# EAGLE schematic Payload (EAGLE 9.6.2)

## Sheet 1 of 2
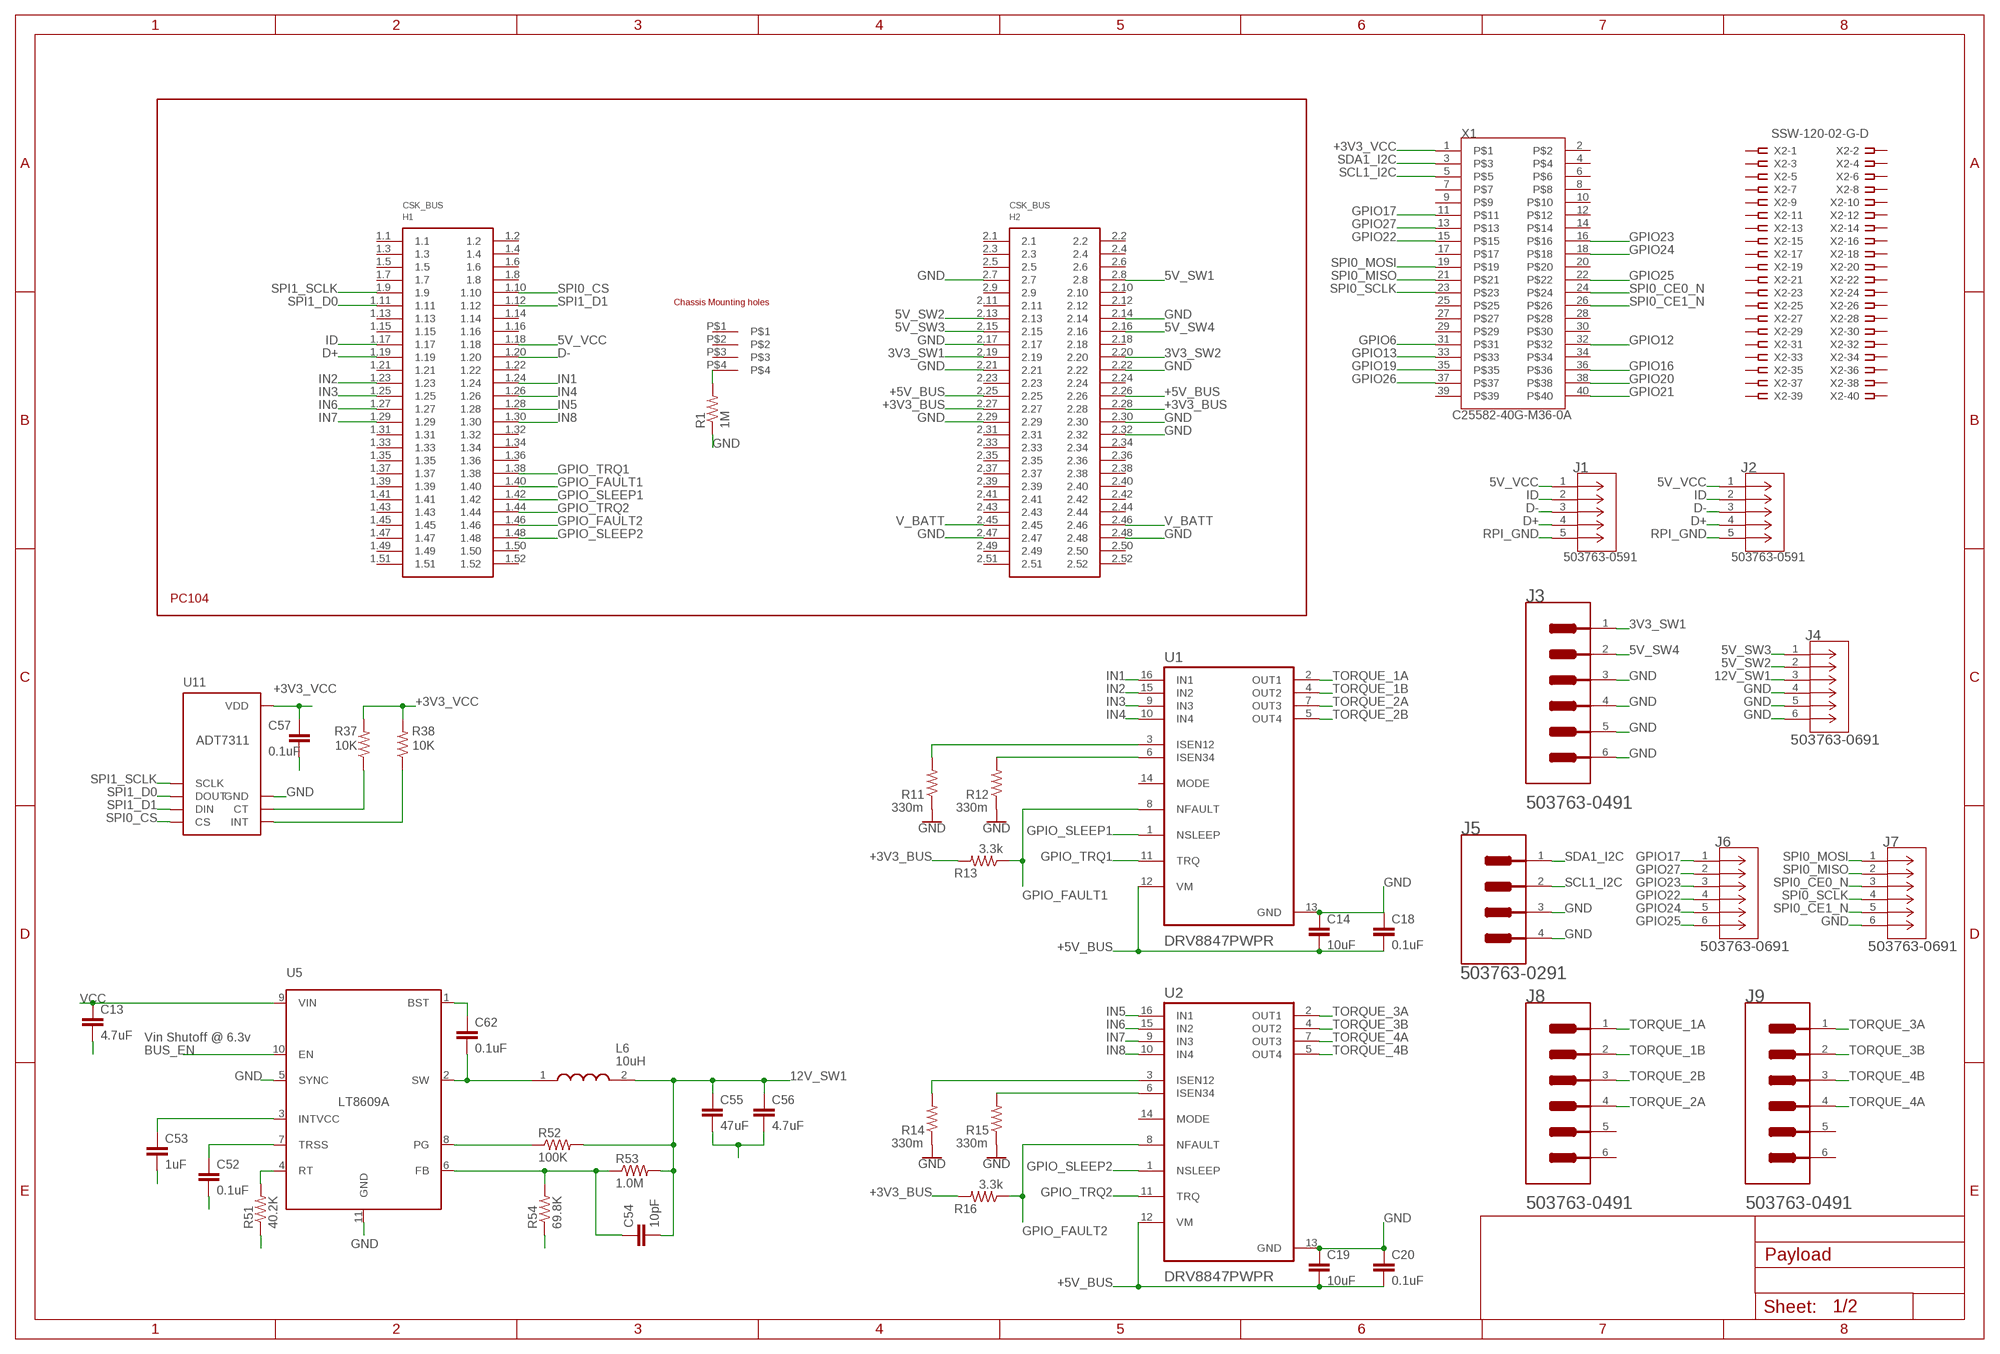
[diagram p0: schematic, sheet 1]

### Parts
C13  4.7uF  CAP0805  [0805]
C14  10uF  CAP0805  [0805]
C18  0.1uF  CAP0805  [0805]
C19  10uF  CAP0805  [0805]
C20  0.1uF  CAP0805  [0805]
C52  0.1uF  CAP0805  [0805]
C53  1uF  CAP0805  [0805]
C54  10pF  CAP0805  [0805]
C55  47uF  CAP1210  [1210]
C56  4.7uF  CAP0805  [0805]
C57  0.1uF  CAP0805  [0805]
C62  0.1uF  CAP0805  [0805]
H1  PC104_WCONN  [PC104_WCONN]
J1  503763-0591  [CONN_5037630591_MOL]
J2  503763-0591  [CONN_5037630591_MOL]
J3  MOLEX_503763-0491MOLEX_503763-0491_0_0  [MOLEX_503763-0491_0]
J4  503763-0691  [CONN_503763-0691_MOL]
J5  MOLEX_503763-0291MOLEX_503763-0291_0_0  [MOLEX_503763-0291_0]
J6  503763-0691  [CONN_503763-0691_MOL]
J7  503763-0691  [CONN_503763-0691_MOL]
J8  MOLEX_503763-0491MOLEX_503763-0491_0_0  [MOLEX_503763-0491_0]
J9  MOLEX_503763-0491MOLEX_503763-0491_0_0  [MOLEX_503763-0491_0]
L6  10uH  XFL4020-222MEC  [XFL4030472MEB]
R1  1M  RESISTOR0805-RES  [0805]
R11  330m  RESISTOR0805-RES  [0805]
R12  330m  RESISTOR0805-RES  [0805]
R13  3.3k  RESISTOR0805-RES  [0805]
R14  330m  RESISTOR0805-RES  [0805]
R15  330m  RESISTOR0805-RES  [0805]
R16  3.3k  RESISTOR0805-RES  [0805]
R37  10K  RESISTOR0805-RES  [0805]
R38  10K  RESISTOR0805-RES  [0805]
R51  40.2K  RESISTOR0805-RES  [0805]
R52  100K  RESISTOR0805-RES  [0805]
R53  1.0M  RESISTOR0805-RES  [0805]
R54  69.8K  RESISTOR0805-RES  [0805]
U1  DRV8847PWPR  [SOP65P640X120-17N]
U2  DRV8847PWPR  [SOP65P640X120-17N]
U5  LT8609A  [MSOP-10_MSE]
U11  ADT7311  [SOIC-8]
X1  C25582-40G-M36-0A  [ADAFRUIT_C25582-40G-M36-0A_0]
X2  SSW-120-02-G-D  [SSW-120-02-G-D]

### Nets
3V3_SW1: H1.2.19 J3.1
3V3_SW2: H1.2.20
5V_SW1: H1.2.8
5V_SW2: H1.2.13 J4.2
5V_SW3: H1.2.15 J4.1
5V_SW4: H1.2.16 J3.2
5V_VCC: H1.1.18 J1.1 J2.1
12V_SW1: C54.2 C55.1 C56.1 J4.3 L6.2 R52.2 R53.2
+3V3_BUS: H1.2.27 H1.2.28 R13.2 R16.2
+3V3_VCC: C57.1 R37.2 R38.2 U11.8(VDD) X1.1
+5V_BUS: C14.2 C18.2 C19.2 C20.2 H1.2.25 H1.2.26 U1.12(VM) U2.12(VM)
BST_3V3_BUS: C62.1 U5.1(BST)
BUS_EN: U5.10(EN)
D+: H1.1.19 J1.4 J2.4
D-: H1.1.20 J1.3 J2.3
FB_3V3_BUS: C54.1 R53.1 R54.2 U5.6(FB)
GND: C14.1 C18.1 C19.1 C20.1 C52.2 C53.2 C55.2 C56.2 C57.2 H1.2.7 H1.2.14 H1.2.17 H1.2.21 H1.2.22 H1.2.29 H1.2.30 H1.2.32 H1.2.47 H1.2.48 J3.3 J3.4 J3.5(MNT_1) J3.6(MNT_2) J4.4 J4.5 J4.6 J5.3(MNT_1) J5.4(MNT_2) J7.6 R1.1 R11.1 R12.1 R14.1 R15.1 R51.1 R54.1 U1.13(GND) U2.13(GND) U5.5(SYNC) U5.11(GND) U11.7(GND) ; also sheet 2
GND1: C13.2
GPIO6: X1.31
GPIO12: X1.32
GPIO13: X1.33
GPIO16: X1.36
GPIO17: J6.1 X1.11
GPIO19: X1.35
GPIO20: X1.38
GPIO21: X1.40
GPIO22: J6.4 X1.15
GPIO23: J6.3 X1.16
GPIO24: J6.5 X1.18
GPIO25: J6.6 X1.22
GPIO26: X1.37
GPIO27: J6.2 X1.13
GPIO_FAULT1: H1.1.40 R13.1 U1.8(NFAULT)
GPIO_FAULT2: H1.1.46 R16.1 U2.8(NFAULT)
GPIO_SLEEP1: H1.1.42 U1.1(NSLEEP)
GPIO_SLEEP2: H1.1.48 U2.1(NSLEEP)
GPIO_TRQ1: H1.1.38 U1.11(TRQ)
GPIO_TRQ2: H1.1.44 U2.11(TRQ)
ID: H1.1.17 J1.2 J2.2
IN1: H1.1.24 U1.16(IN1)
IN2: H1.1.23 U1.15(IN2)
IN3: H1.1.25 U1.9(IN3)
IN4: H1.1.26 U1.10(IN4)
IN5: H1.1.28 U2.16(IN1)
IN6: H1.1.27 U2.15(IN2)
IN7: H1.1.29 U2.9(IN3)
IN8: H1.1.30 U2.10(IN4)
N$9: H1.P$4 R1.2
N$16: R12.2 U1.6(ISEN34)
N$18: R11.2 U1.3(ISEN12)
N$20: R15.2 U2.6(ISEN34)
N$21: R14.2 U2.3(ISEN12)
PG_3V3_BUS: R52.1 U5.8(PG)
RPI_GND: J1.5 J2.5
RT_3V3_BUS: R51.2 U5.4(RT)
SCL1_I2C: J5.2 X1.5
SDA1_I2C: J5.1 X1.3
SPI0_CE0_N: J7.3 X1.24
SPI0_CE1_N: J7.5 X1.26
SPI0_CS: H1.1.10 U11.4(CS)
SPI0_MISO: J7.2 X1.21
SPI0_MOSI: J7.1 X1.19
SPI0_SCLK: J7.4 X1.23
SPI1_D0: H1.1.11 U11.2(DOUT)
SPI1_D1: H1.1.12 U11.3(DIN)
SPI1_SCLK: H1.1.9 U11.1(SCLK)
SW_3V3_BUS: C62.2 L6.1 U5.2(SW)
TORQUE_1A: J8.1 U1.2(OUT1)
TORQUE_1B: J8.2 U1.4(OUT2)
TORQUE_2A: J8.4 U1.7(OUT3)
TORQUE_2B: J8.3 U1.5(OUT4)
TORQUE_3A: J9.1 U2.2(OUT1)
TORQUE_3B: J9.2 U2.4(OUT2)
TORQUE_4A: J9.4 U2.7(OUT3)
TORQUE_4B: J9.3 U2.5(OUT4)
TRSS_3V3_BUS: C52.1 U5.7(TRSS)
U11_CT: R37.1 U11.6(CT)
U11_INT: R38.1 U11.5(INT)
V_BATT: H1.2.45 H1.2.46 ; also sheet 2
VCC: C13.1 U5.9(VIN) ; also sheet 2
VCC_3V3_BUS: C53.1 U5.3(INTVCC)
Unconnected: H1.1.1 H1.1.2 H1.1.3 H1.1.4 H1.1.5 H1.1.6 H1.1.7 H1.1.8 H1.1.13 H1.1.14 H1.1.15 H1.1.16 H1.1.21 H1.1.22 H1.1.31 H1.1.32 H1.1.33 H1.1.34 H1.1.35 H1.1.36 H1.1.37 H1.1.39 H1.1.41 H1.1.43 H1.1.45 H1.1.47 H1.1.49 H1.1.50 H1.1.51 H1.1.52 H1.2.1 H1.2.2 H1.2.3 H1.2.4 H1.2.5 H1.2.6 H1.2.9 H1.2.10 H1.2.11 H1.2.12 H1.2.18 H1.2.23 H1.2.24 H1.2.31 H1.2.33 H1.2.34 H1.2.35 H1.2.36 H1.2.37 H1.2.38 H1.2.39 H1.2.40 H1.2.41 H1.2.42 H1.2.43 H1.2.44 H1.2.49 H1.2.50 H1.2.51 H1.2.52 H1.P$1 H1.P$2 H1.P$3 J8.5(MNT_1) J8.6(MNT_2) J9.5(MNT_1) J9.6(MNT_2) U1.14(MODE) U2.14(MODE) X1.2 X1.4 X1.6 X1.7 X1.8 X1.9 X1.10 X1.12 X1.14 X1.17 X1.20 X1.25 X1.27 X1.28 X1.29 X1.30 X1.34 X1.39 X2.1 X2.2 X2.3 X2.4 X2.5 X2.6 X2.7 X2.8 X2.9 X2.10 X2.11 X2.12 X2.13 X2.14 X2.15 X2.16 X2.17 X2.18 X2.19 X2.20 X2.21 X2.22 X2.23 X2.24 X2.25 X2.26 X2.27 X2.28 X2.29 X2.30 X2.31 X2.32 X2.33 X2.34 X2.35 X2.36 X2.37 X2.38 X2.39 X2.40

### Notes on the sheet
- Vin Shutoff @ 6.3v

## Sheet 2 of 2
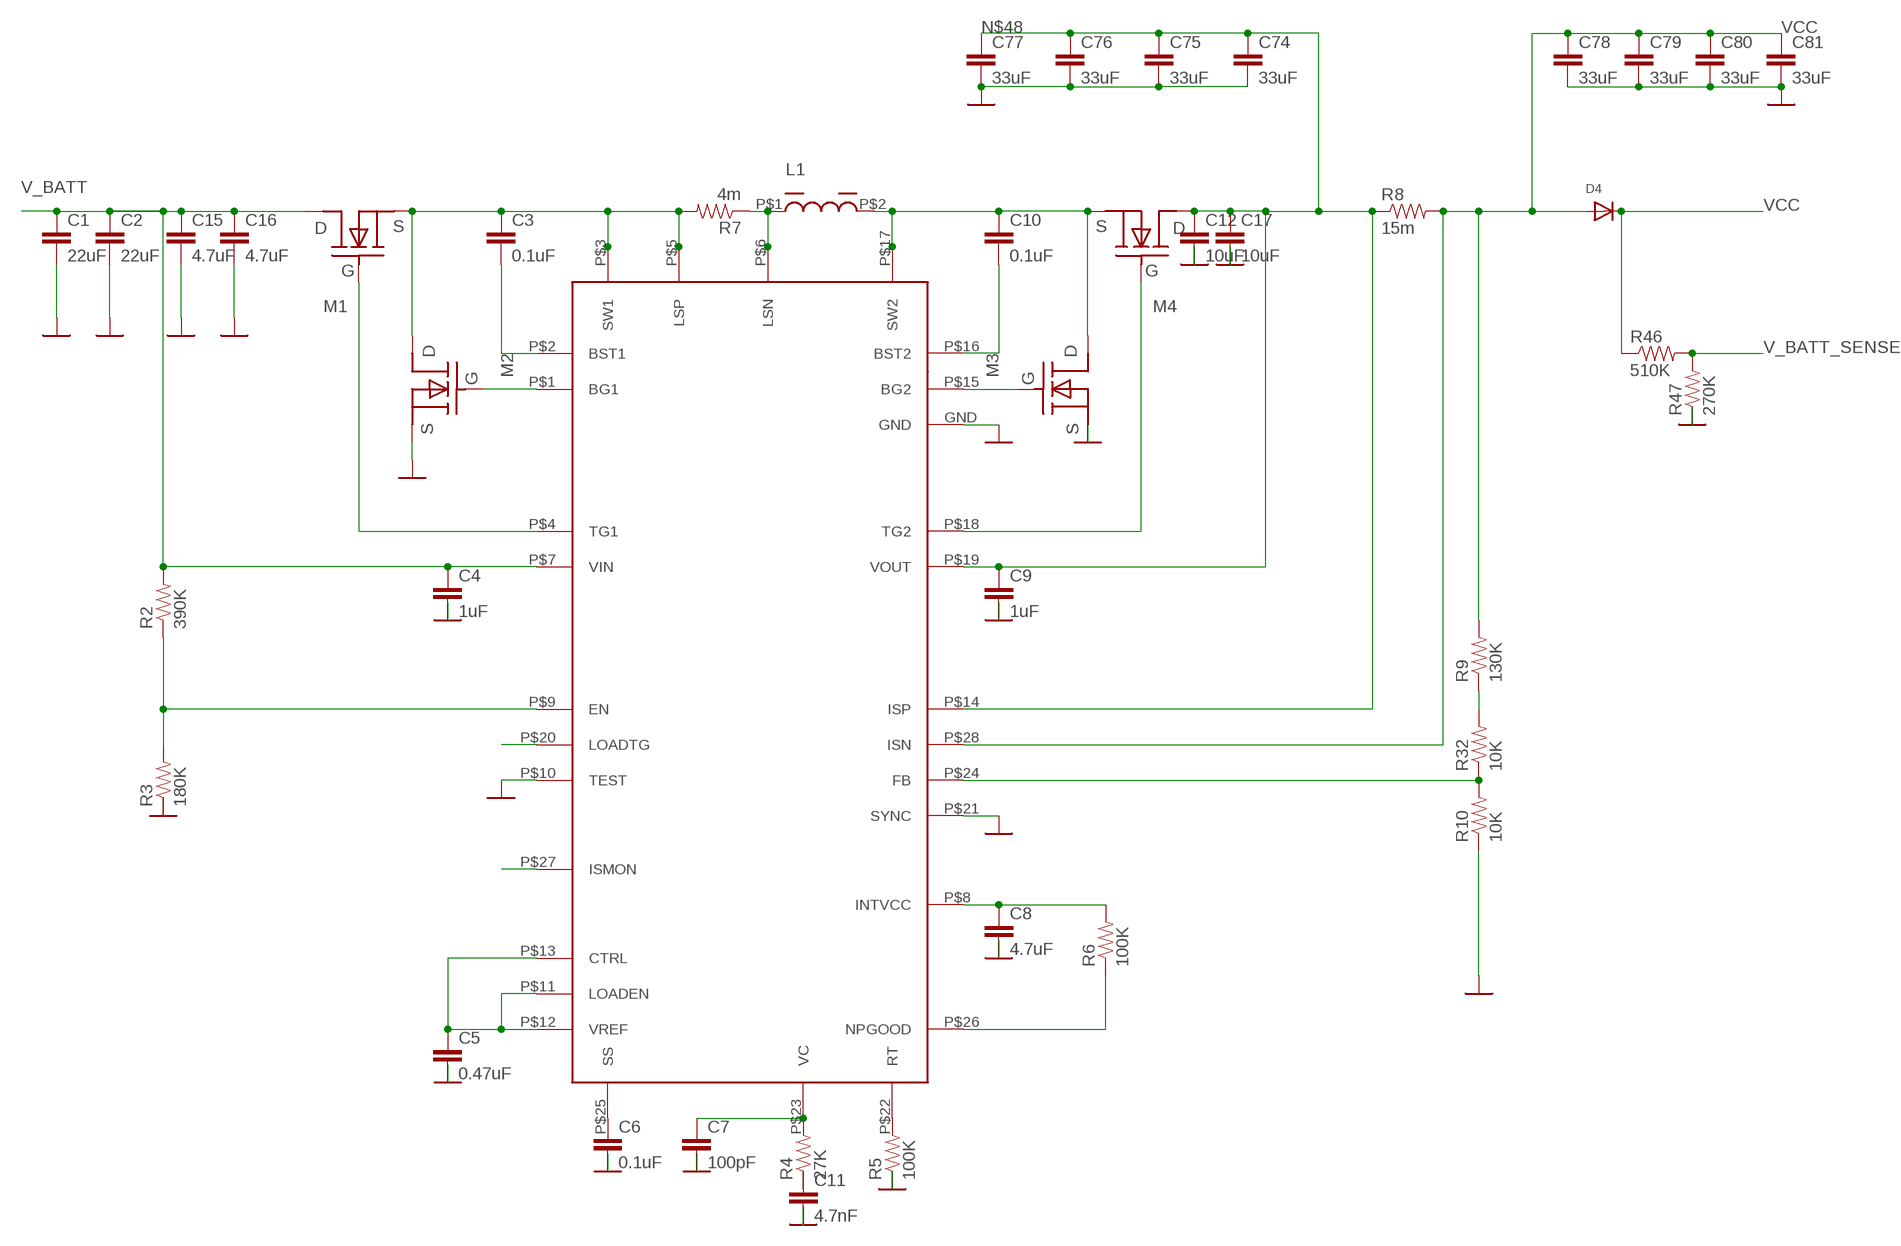
[diagram p1: schematic, sheet 2]

### Parts
C1  22uF  CAP0805  [0805]
C2  22uF  CAP0805  [0805]
C3  0.1uF  CAP0805  [0805]
C4  1uF  CAP0805  [0805]
C5  0.47uF  CAP0805  [0805]
C6  0.1uF  CAP0805  [0805]
C7  100pF  CAP0805  [0805]
C8  4.7uF  CAP0805  [0805]
C9  1uF  CAP0805  [0805]
C10  0.1uF  CAP0805  [0805]
C11  4.7nF  CAP0805  [0805]
C12  10uF  CAP0805  [0805]
C15  4.7uF  CAP0805  [0805]
C16  4.7uF  CAP0805  [0805]
C17  10uF  CAP0805  [0805]
C74  33uF  CAP1206  [1206]
C75  33uF  CAP1206  [1206]
C76  33uF  CAP1206  [1206]
C77  33uF  CAP1206  [1206]
C78  33uF  CAP1206  [1206]
C79  33uF  CAP1206  [1206]
C80  33uF  CAP1206  [1206]
C81  33uF  CAP1206  [1206]
D4  DIODE_SOD-123FL  [SOD-123FL]
L1  6uH  7443551600  [7443551600]
M1  BSZ100N06LS3  [BSZ100N06LS3]
M2  BSZ100N06LS3  [BSZ100N06LS3]
M3  BSZ033NE2LS5  BSZ100N06LS3  [BSZ100N06LS3]
M4  BSZ033NE2LS5  BSZ100N06LS3  [BSZ100N06LS3]
R2  390K  RESISTOR0805-RES  [0805]
R3  180K  RESISTOR0805-RES  [0805]
R4  27K  RESISTOR0805-RES  [0805]
R5  100K  RESISTOR0805-RES  [0805]
R6  100K  RESISTOR0805-RES  [0805]
R7  4m  RESISTOR0805-RES  [0805]
R8  15m  RESISTOR0805-RES  [0805]
R9  130K  RESISTOR0805-RES  [0805]
R10  10K  RESISTOR0805-RES  [0805]
R32  10K  RESISTOR0805-RES  [0805]
R46  510K  RESISTOR0805-RES  [0805]
R47  270K  RESISTOR0805-RES  [0805]
U$2  LT8309EFE  [LT8309EFE]

### Nets
GND: C1.2 C2.2 C4.2 C5.2 C6.2 C7.2 C8.2 C9.2 C11.2 C12.2 C15.2 C16.2 C17.2 C74.2 C75.2 C76.2 C77.2 C78.2 C79.2 C80.2 C81.2 M2.P$2(S) M2.P$3(S) M2.P$4(S) M3.P$2(S) M3.P$3(S) M3.P$4(S) R3.1 R5.1 R10.1 R47.1 U$2.GND U$2.P$10(TEST) U$2.P$21(SYNC) ; also sheet 1
N$10: C3.1 M1.P$2(S) M1.P$3(S) M1.P$4(S) M2.P$5(D) M2.P$6(D) M2.P$7(D) M2.P$8(D) M2.P$9(D) R7.2 U$2.P$3(SW1) U$2.P$5(LSP)
N$11: C3.2 U$2.P$2(BST1)
N$12: C6.1 U$2.P$25(SS)
N$13: R5.2 U$2.P$22(RT)
N$14: C10.1 L1.P$2 M3.P$5(D) M3.P$6(D) M3.P$7(D) M3.P$8(D) M3.P$9(D) M4.P$2(S) M4.P$3(S) M4.P$4(S) U$2.P$17(SW2)
N$15: R9.1 R32.2
N$17: M2.P$1(G) U$2.P$1(BG1)
N$34: M1.P$1(G) U$2.P$4(TG1)
N$35: M3.P$1(G) U$2.P$15(BG2)
N$36: R2.1 R3.2 U$2.P$9(EN)
N$37: U$2.P$20(LOADTG)
N$38: U$2.P$27(ISMON)
N$39: C5.1 U$2.P$11(LOADEN) U$2.P$12(VREF) U$2.P$13(CTRL)
N$41: C7.1 R4.2 U$2.P$23(VC)
N$43: R6.1 U$2.P$26(NPGOOD)
N$44: C8.1 R6.2 U$2.P$8(INTVCC)
N$45: L1.P$1 R7.1 U$2.P$6(LSN)
N$47: C10.2 U$2.P$16(BST2)
N$48: C9.1 C12.1 C17.1 C74.1 C75.1 C76.1 C77.1 M4.P$5(D) M4.P$6(D) M4.P$7(D) M4.P$8(D) M4.P$9(D) R8.1 U$2.P$14(ISP) U$2.P$19(VOUT)
N$49: M4.P$1(G) U$2.P$18(TG2)
N$51: R10.2 R32.1 U$2.P$24(FB)
N$55: C11.1 R4.1
V_BATT: C1.1 C2.1 C4.1 C15.1 C16.1 M1.P$5(D) M1.P$6(D) M1.P$7(D) M1.P$8(D) M1.P$9(D) R2.2 U$2.P$7(VIN) ; also sheet 1
V_BATT_SENSE: R46.2 R47.2
VCC: C78.1 C79.1 C80.1 C81.1 D4.A D4.C R8.2 R9.2 R46.1 U$2.P$28(ISN) ; also sheet 1

## Library data of the parts
C1-C20 C52-C57 C62 C74-C81 = HSFL_Main_Library:CAP: Capacitor Standard 0603 ceramic capacitor, and 0.1" leaded capacitor.
D4 = adafruit:DIODE: Diode SMADIODE - SMA Surface Mount Package 20V 1A Schottky Diode Digikey: 641-1014-6-ND DO-1N4148 - Through Hole Small Current Diode SOD-123 20V 1 A (.5mV Vf) Schottky Diode - Digikey: MBRX120TPMSCT-ND SOD-323 10V 570mA (.38mV Vf, 3ns) Schottky Diode - Digikey: ZLLS410CT-ND SOD-523 30V 30mA Schottky Diode (RB751S-40TE61) - Digikey: RB751S-40TE61CT-ND SOT23-R/W - SOT23 Package (R = Solder Paste/Reflow Ovens, W = Hand-Soldering) BAT54Film 40V 300mA - Digikey: 497-7162-1-ND
H1 = HSFL_Main_Library:PC104_WCONN
J1 J2 = Molex - 503763-0591:503763-0591; BUILT_BY: EMA_Cory; COPYRIGHT: Copyright (C) 2018 Accelerated Designs. All rights reserved; DATASHEET: https://www.molex.com/pdm_docs/sd/5037630591_sd.pdf; MANUFACTURER_PART_NUMBER: 503763-0591; SOURCELIBRARY: Add_to_database_2020-12-14; VENDOR: Molex Connector Corporation
J3 J8 J9 = Molex - 503763-0491:MOLEX_503763-0491: Wire-To-Board Connector, Pico-Lock 503763 Series, Surface Mount, Header, 4 Contacts, 1 mm; AUTOMOTIVE: No; CENTROID_NOT_SPECIFIED: No; CONN_GENDER: Male; CONN_ORIENTATION: Right Angle; CONTACT_MATERIAL: Gold,Nickel; CURRENT_RATING: 1.5A; DATASHEET: https://www.molex.com/webdocs/datasheets/pdf/en-us/5037630491_PCB_HEADERS.pdf; DEVICE_CLASS_L1: Connectors; DEVICE_CLASS_L2: Headers and Wire Housings; DEVICE_CLASS_L3: unset; DIGIKEY_DESCRIPTION: CONN HEADER 1MM R/A 4CKT; DIGIKEY_PART_NUMBER: WM10655CT-ND; FOOTPRINT_URL: https://www.molex.com/pdm_docs/sd/5037630491_sd.pdf; FOOTPRINT_VARIANT_NAME_0: Recommended_Land_Pattern; HEIGHT: 1.7mm; LEAD_FREE: Yes; MF: Molex; MFG_PACKAGE_IDENT: 503763-0491; MFG_PACKAGE_IDENT_DATE: 0; MFG_PACKAGE_IDENT_REV: 0; MOUSER_PART_NUMBER: 538-503763-0491; MPN: 503763-0491; NUMBER_OF_CONTACTS: 4; NUMBER_OF_ROWS: 1; PACKAGE: HDR4; PITCH: 1mm; PREFIX: J; ROHS: Yes; TEMPERATURE_RANGE_HIGH: +105°C; TEMPERATURE_RANGE_LOW: -40°C; VERIFICATION_VERSION: 0.0.0.1; VOLTAGE_RATING: 150V
J4 J6 J7 = Molex - 503763-0691:503763-0691; BUILT_BY: EMA_Cory; COPYRIGHT: Copyright (C) 2018 Accelerated Designs. All rights reserved; DATASHEET: https://www.digikey.com/products/en?keywords=503763-0691; MANUFACTURER_PART_NUMBER: 503763-0691; SOURCELIBRARY: Molex_2020-01-22; VENDOR: Molex Connector Corporation
J5 = Molex - 503763-0291:MOLEX_503763-0291: 2 Positions Header Connector 0.039" (1.00mm) Surface Mount, Right Angle Gold; CENTROID_NOT_SPECIFIED: No; DATASHEET: http://www.molex.com/pdm_docs/sd/5037630291_sd.pdf; DIGIKEY_DESCRIPTION: CONN HEADER 1MM R/A 2CKT; DIGIKEY_PART_NUMBER: WM10654CT-ND; LEAD_FREE: yes; MF: Molex; MOUSER_PART_NUMBER: 538-503763-0291; MPN: 503763-0291; PACKAGE: HDR02; PREFIX: J; ROHS: yes; TEMPERATURE_RANGE_HIGH: +105°C; TEMPERATURE_RANGE_LOW: -40°C
L1 = HSFL_Main_Library:7443551600
L6 = HSFL_Main_Library:XFL4020-222MEC: COILCRAFT - XFL4020-222MEC - INDUCTOR, 2.2UH, 8A, 20%, PWR, 38MHZ Source: Datasheet <https://www.coilcraft.com/pdfs/xfl4020.pdf>; ARROW_PART_NUMBER: XFL4020-222MEC; DESCRIPTION: COILCRAFT - XFL4020-222MEC - INDUCTOR, 2.2UH, 8A, 20%, PWR, 38MHZ; HEIGHT: 3mm; MANUFACTURER_NAME: COILCRAFT; MANUFACTURER_PART_NUMBER: XFL4020-222MEC; MOUSER_PART_NUMBER: 994-XFL4020-222MEC; MOUSER_PRICE-STOCK: https://www.mouser.co.uk/ProductDetail/Coilcraft/XFL4020-222MEC?qs=zCSbvcPd3pbe5jEAG1ZkEA%3D%3D
M1-M4 = HSFL_Main_Library:BSZ100N06LS3
R1-R16 R32 R37 R38 R46 R47 R51-R54 = HSFL_Main_Library:RESISTOR: Resistor Basic schematic elements and footprints for 0603, 1206, and PTH resistors.
U1 U2 = DRV8847PWPR:DRV8847PWPR: None Check prices <https://pricing.snapeda.com/parts/DRV8847PWPR/Texas%20Instruments/view-part?ref=eda>; AVAILABILITY: Warning; DESCRIPTION: 18-V, 2-A dual H-bridge motor driver with current regulation & independent half-bridge control 16-HTSSOP -40 to 125; MF: Texas Instruments; MP: DRV8847PWPR; PACKAGE: HTSSOP-16 Texas Instruments; PRICE: None; PURCHASE-URL: https://pricing.snapeda.com/search/part/DRV8847PWPR/?ref=eda
U5 = HSFL_Main_Library:LT8609A
U11 = HSFL_Main_Library:ADT7311: The ADT7311 is a high accuracy digital temperature sensor in a narrow 8-lead SOIC package. It contains a band gap temperature reference and a 16-bit ADC to monitor and digitize the temperature to a 0.0078°C resolution. The ADC resolution, by default, is set to 13 bits (0.0625°C). The ADC resolution is a user programmable mode that can be changed through the serial interface. br> The ADT7311 is guaranteed to operate over supply voltages from 2.7 V to 5.5 V. Operating at 3.3 V, the average supply current is typically 210 μA. The ADT7311 has a shutdown mode that powers down the device and offers a shutdown current of typically 2 μA. The ADT7311 is rated for operation over the −40°C to +150°C temperature range. br> The CT pin is an open-drain output that becomes active when the temperature exceeds a programmable critical temperature limit. The default critical temperature limit is 147°C. The INT pin is also an open-drain output that becomes active when the temperature exceeds a programmable limit. The INT and CT pins can operate in either comparator or interrupt mode.
U$2 = Personal:LT8309EFE
X1 = Adafruit - C25582-40G-M36-0A:C25582-40G-M36-0A
X2 = con-samtec:SSW-120-02-G: THROUGH-HOLE .025" SQ POST SOCKET Source: Samtec SSW.pdf; MF: Samtec Inc.; MPN: SSW-120-02-G-D; OC_FARNELL: unknown; OC_NEWARK: 11P9639